# EAGLE design usbasp (EAGLE 5.11)
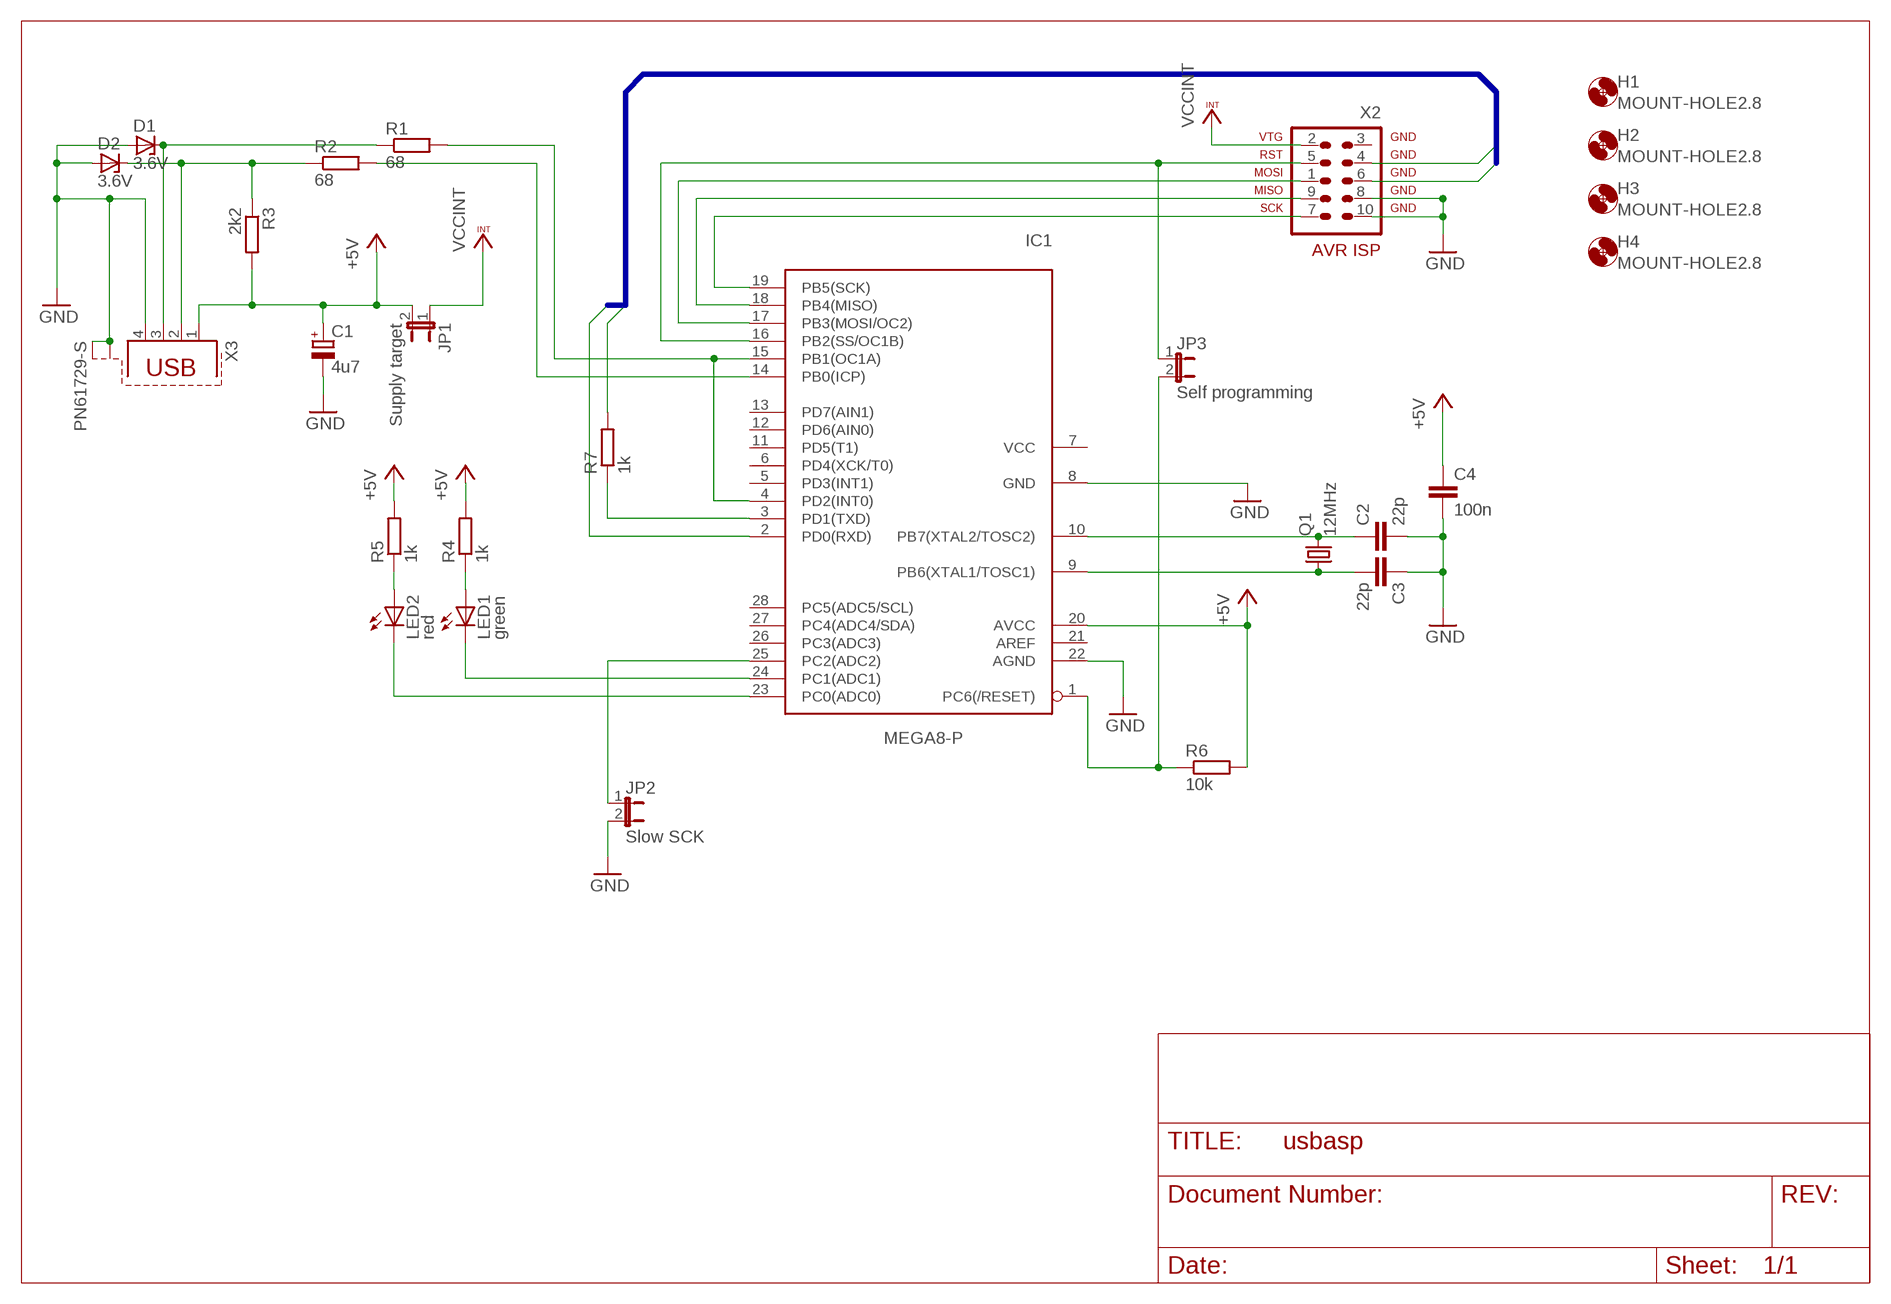
[diagram p0: schematic, sheet 1]

## Parts
C1  4u7  CPOL-EUE2.5-6  [E2,5-6]
C2  22p  C-EU025-024X044  [C025-024X044]
C3  22p  C-EU025-024X044  [C025-024X044]
C4  100n  C-EU025-025X050  [C025-025X050]
D1  3.6V  ZENER-DIODEDO35Z10  [DO35Z10]
D2  3.6V  ZENER-DIODEDO35Z10  [DO35Z10]
H1  MOUNT-HOLE2.8  [2,8]
H2  MOUNT-HOLE2.8  [2,8]
H3  MOUNT-HOLE2.8  [2,8]
H4  MOUNT-HOLE2.8  [2,8]
IC1  MEGA8-P  [DIL28-3]
JP1  Supply target  JP1E  [JP1]
JP2  Slow SCK  JP1E  [JP1]
JP3  Self programming  JP1E  [JP1]
LED1  green  LED3MM  [LED3MM]
LED2  red  LED3MM  [LED3MM]
Q1  12MHz  CRYSTALHC49U70  [HC49U70]
R1  68  R-EU_0207/10  [0207/10]
R2  68  R-EU_0207/10  [0207/10]
R3  2k2  R-EU_0207/10  [0207/10]
R4  1k  R-EU_0207/10  [0207/10]
R5  1k  R-EU_0207/10  [0207/10]
R6  10k  R-EU_0207/10  [0207/10]
R7  1k  R-EU_0207/10  [0207/10]
X2  AVR-ISP-10ML  [ML10]
X3  PN61729-S  [PN61729-S]

## Nets
+5V: C1.+ C4.1 IC1.20(AVCC) JP1.2 R3.2 R4.2 R5.2 R6.2 X3.1
GND: C1.- C2.2 C3.1 C4.2 D1.A D2.A IC1.8(GND) IC1.22(AGND) JP2.2 X2.8 X2.10 X3.4 X3.S1 X3.S2
N$1: D2.C R2.1 R3.1 X3.2
N$2: D1.C R1.1 X3.3
N$3: IC1.4(PD2(INT0)) IC1.15(PB1(OC1A)) R1.2
N$4: IC1.14(PB0(ICP)) R2.2
N$5: IC1.16(PB2(SS/OC1B)) JP3.1 X2.5
N$6: IC1.17(PB3(MOSI/OC2)) X2.1
N$7: IC1.18(PB4(MISO)) X2.9
N$8: IC1.19(PB5(SCK)) X2.7
N$9: C2.1 IC1.10(PB7(XTAL2/TOSC2)) Q1.2
N$10: IC1.25(PC2(ADC2)) JP2.1
N$11: IC1.24(PC1(ADC1)) LED1.K(C)
N$12: C3.2 IC1.9(PB6(XTAL1/TOSC1)) Q1.1
N$13: LED2.A R5.1
N$14: IC1.23(PC0(ADC0)) LED2.K(C)
N$16: LED1.A R4.1
N$17: IC1.3(PD1(TXD)) R7.1
N$19: IC1.1(PC6(/RESET)) JP3.2 R6.1
RXD: IC1.2(PD0(RXD)) X2.6
TXD: R7.2 X2.4
VCCINT: JP1.1 X2.2
Unconnected: IC1.5(PD3(INT1)) IC1.6(PD4(XCK/T0)) IC1.7(VCC) IC1.11(PD5(T1)) IC1.12(PD6(AIN0)) IC1.13(PD7(AIN1)) IC1.21(AREF) IC1.26(PC3(ADC3)) IC1.27(PC4(ADC4/SDA)) IC1.28(PC5(ADC5/SCL)) X2.3

## Buses
SERIAL:RXD,TXD

## Library data of the parts
C1 = resistor:CPOL-EU: POLARIZED CAPACITOR, European symbol
C2-C4 = resistor:C-EU: CAPACITOR, European symbol
D1 D2 = diode:ZENER-DIODE: Z-Diode
H1-H4 = holes:MOUNT-HOLE: MOUNTING HOLE with drill center marker
IC1 = atmel-1:MEGA8-P: MICROCONTROLLER 8 Kbytes FLASH 1 kbytes SRAM 512 bytes EEPROM USART 4-channel 10 bit ADC 2-channel 8 bit ADC
JP1-JP3 = jumper:JP1E: JUMPER
LED1 LED2 = led:LED: LED OSRAM: - CHIPLED LG R971, LG N971, LY N971, LG Q971, LY Q971, LO R971, LY R971 LH N974, LH R974 LS Q976, LO Q976, LY Q976 LO Q996 - Hyper CHIPLED LW Q18S LB Q993, LB Q99A, LB R99A - SideLED LS A670, LO A670, LY A670, LG A670, LP A670 LB A673, LV A673, LT A673, LW A673 LH A674 LY A675 LS A676, LA A676, LO A676, LY A676, LW A676 LS A679, LY A679, LG A679 - Hyper Micro SIDELED® LS Y876, LA Y876, LO Y876, LY Y876 LT Y87S - SmartLED LW L88C, LW L88S LB L89C, LB L89S, LG L890 LS L89K, LO L89K, LY L89K LS L896, LA L896, LO L896, LY L896 - TOPLED LS T670, LO T670, LY T670, LG T670, LP T670 LSG T670, LSP T670, LSY T670, LOP T670, LYG T670 LG T671, LOG T671, LSG T671 LB T673, LV T673, LT T673, LW T673 LH T674 LS T676, LA T676, LO T676, LY T676, LB T676, LH T676, LSB T676, LW T676 LB T67C, LV T67C, LT T67C, LS T67K, LO T67K, LY T67K, LW E67C LS E67B, LA E67B, LO E67B, LY E67B, LB E67C, LV E67C, LT E67C LW T67C LS T679, LY T679, LG T679 LS T770, LO T770, LY T770, LG T770, LP T770 LB T773, LV T773, LT T773, LW T773 LH T774 LS E675, LA E675, LY E675, LS T675 LS T776, LA T776, LO T776, LY T776, LB T776 LHGB T686 LT T68C, LB T68C - Hyper Mini TOPLED® LB M676 - Mini TOPLED Santana® LG M470 LS M47K, LO M47K, LY M47K Source: http://www.osram.convergy.de LUXEON: - LUMILED® LXK2-PW12-R00, LXK2-PW12-S00, LXK2-PW14-U00, LXK2-PW14-V00 LXK2-PM12-R00, LXK2-PM12-S00, LXK2-PM14-U00 LXK2-PE12-Q00, LXK2-PE12-R00, LXK2-PE12-S00, LXK2-PE14-T00, LXK2-PE14-U00 LXK2-PB12-K00, LXK2-PB12-L00, LXK2-PB12-M00, LXK2-PB14-N00, LXK2-PB14-P00, LXK2-PB14-Q00 LXK2-PR12-L00, LXK2-PR12-M00, LXK2-PR14-Q00, LXK2-PR14-R00 LXK2-PD12-Q00, LXK2-PD12-R00, LXK2-PD12-S00 LXK2-PH12-R00, LXK2-PH12-S00 LXK2-PL12-P00, LXK2-PL12-Q00, LXK2-PL12-R00 Source: www.luxeon.com KINGBRIGHT: KA-3528ASYC Source: www.kingbright.com
Q1 = crystal:CRYSTAL: CRYSTAL; OC_FARNELL: unknown; OC_NEWARK: unknown
R1-R7 = resistor:R-EU_: RESISTOR, European symbol
X2 = atmel-1:AVR-ISP-10: AVR ISP-10 Serial Programming Header
X3 = con-berg:PN61729-S: BERG USB connector; OC_FARNELL: unknown; OC_NEWARK: unknown

## Board
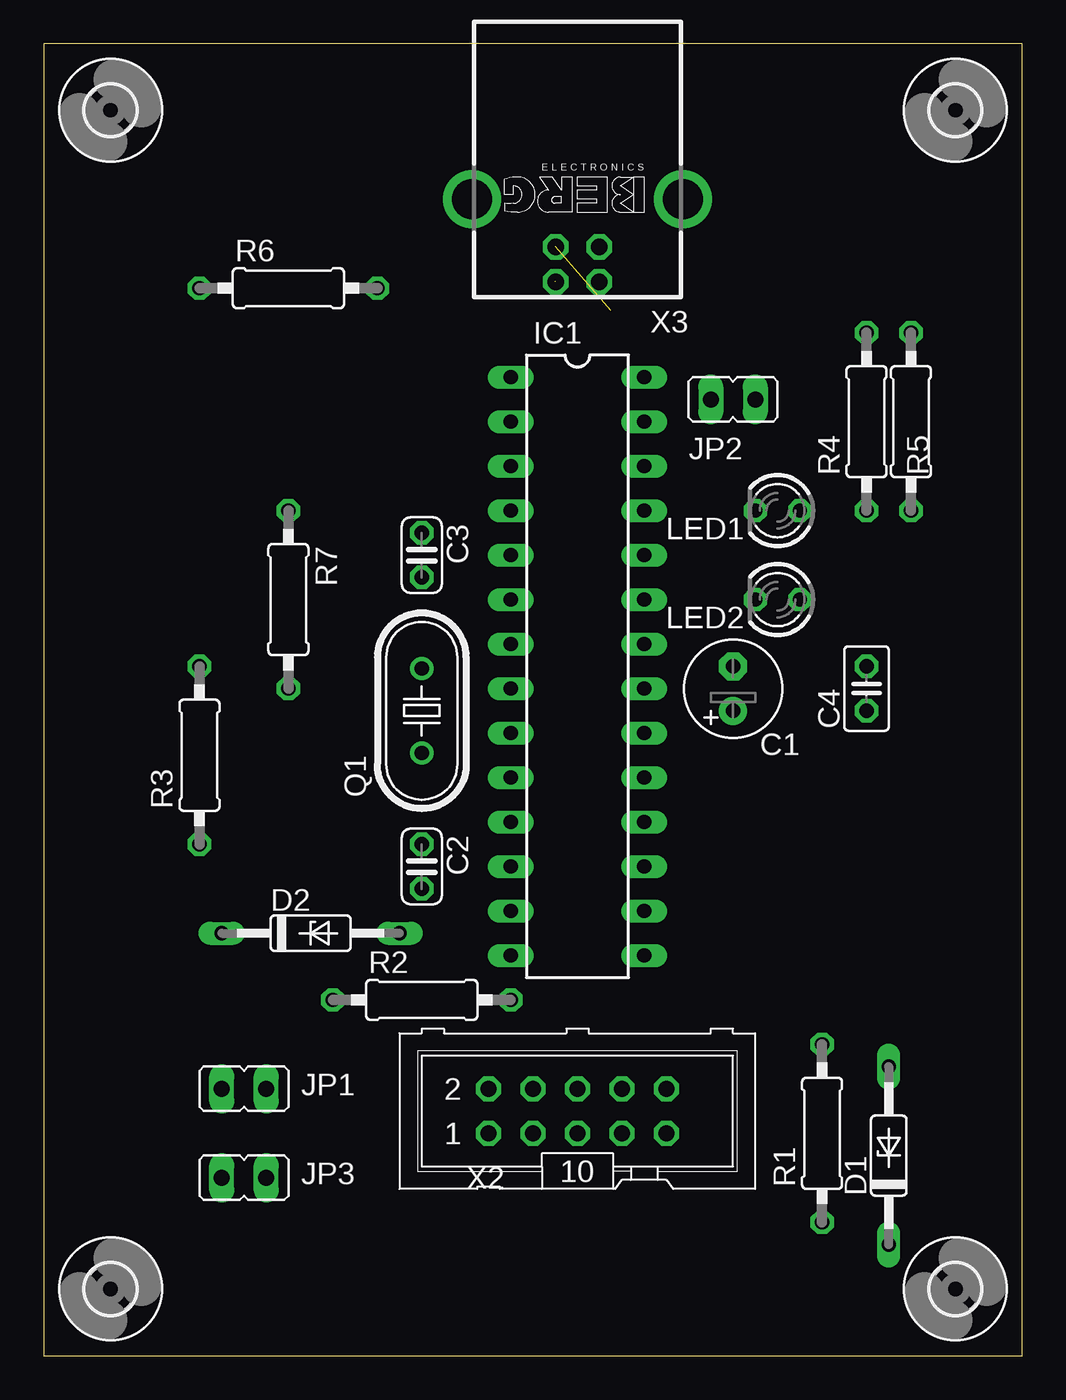
[diagram p1: board, top side]
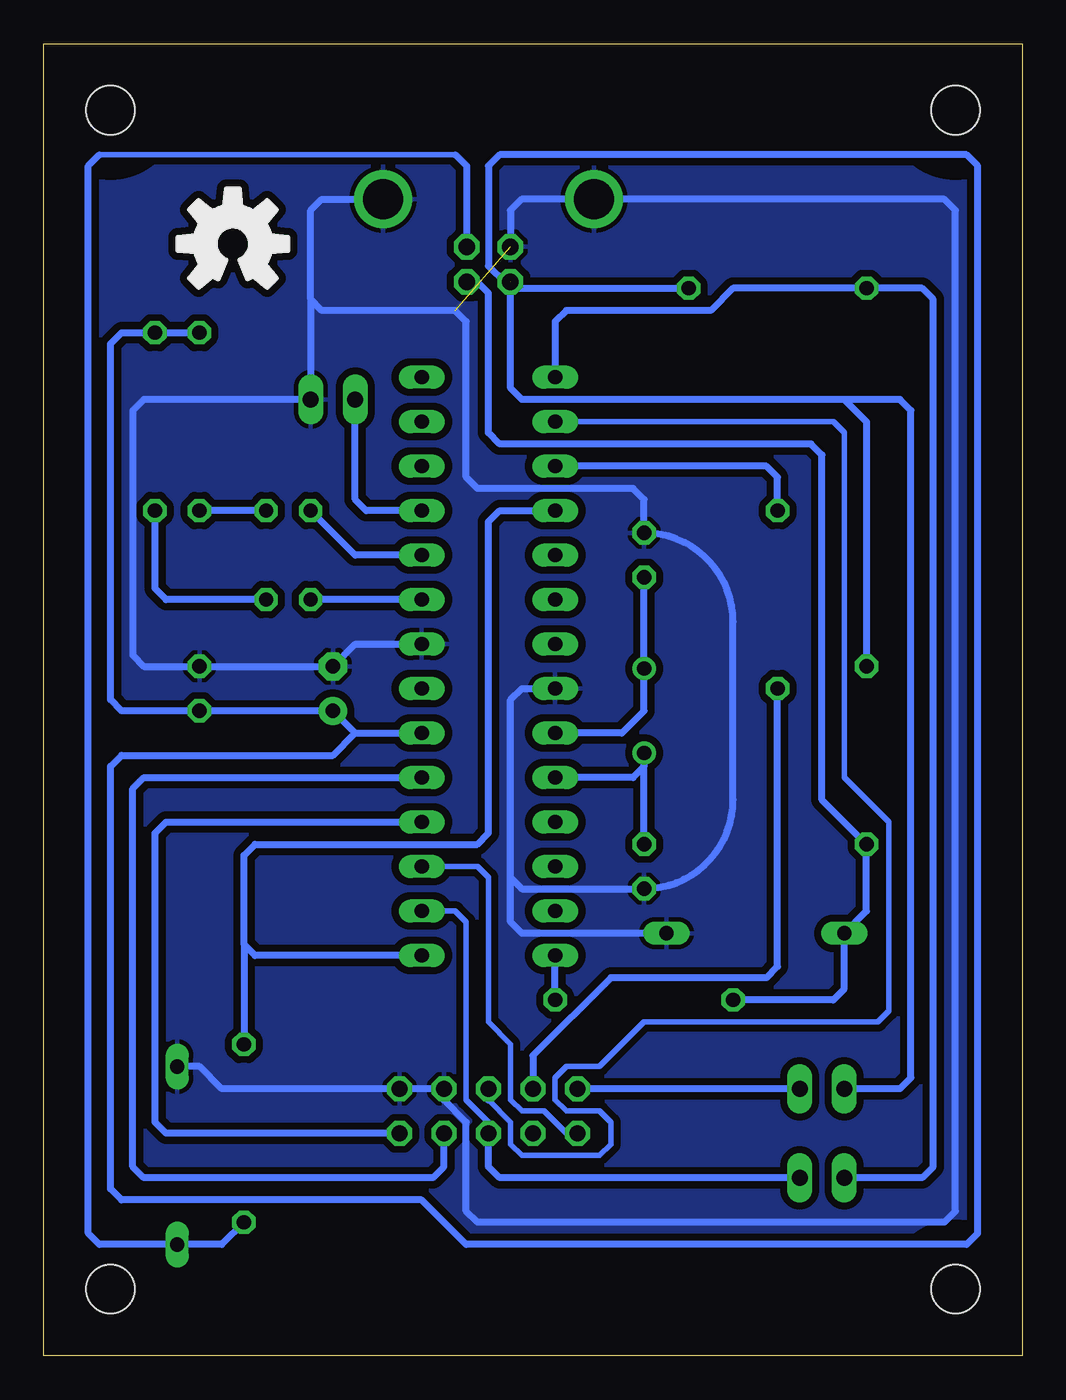
[diagram p2: board, bottom side, seen from below]

Size 55.88 x 74.92 mm. Coordinates in mm from the lower left corner, seen from the top.
Outline: 0,0 55.88,0 55.88,74.92 0,74.92 0,0
Copper layers (1*16): Top 0.035mm / dielectric 1.5mm / Bottom 0.035mm
Design rules "default *": minimum track width 10mil, minimum drill 24mil, track to track 8mil, track to pad 8mil, pad to pad 8mil, via to via 8mil, smd to smd 8mil, copper to edge 30mil, drill to drill 1mil, minimum pad ring 10mil, minimum via ring 8mil, stop-mask expansion 4mil, vias tented up to drill 0mil, thermal gap 10mil

### Footprints (pad centres in the part's own frame; a part is rotated, then mirrored left to right if it is on the bottom)
E2,5-6 = drill 0.813 pad 1.6 round: + -1.27,0 | drill 0.813 pad 1.6 octagon: - 1.27,0
C025-024X044 = drill 0.813 octagon: 1 -1.27,0; 2 1.27,0
C025-025X050 = drill 0.813 octagon: 1 -1.27,0; 2 1.27,0
DO35Z10 = drill 0.813 long: A 5.08,0; C -5.08,0
2,8 = hole 2.8: 0,0
DIL28-3 = drill 0.813 long: 1 -16.51,-3.81; 2 -13.97,-3.81; 3 -11.43,-3.81; 4 -8.89,-3.81; 5 -6.35,-3.81; 6 -3.81,-3.81; 7 -1.27,-3.81; 8 1.27,-3.81; 9 3.81,-3.81; 10 6.35,-3.81; 11 8.89,-3.81; 12 11.43,-3.81; 13 13.97,-3.81; 14 16.51,-3.81; 15 16.51,3.81; 16 13.97,3.81; 17 11.43,3.81; 18 8.89,3.81; 19 6.35,3.81; 20 3.81,3.81; 21 1.27,3.81; 22 -1.27,3.81; 23 -3.81,3.81; 24 -6.35,3.81; 25 -8.89,3.81; 26 -11.43,3.81; 27 -13.97,3.81; 28 -16.51,3.81
JP1 = drill 0.914 long: 1 0,-1.27; 2 0,1.27
LED3MM = drill 0.813 octagon: A -1.27,0; K 1.27,0
HC49U70 = drill 0.813 round: 1 -2.413,0; 2 2.413,0
0207/10 = drill 0.813 octagon: 1 -5.08,0; 2 5.08,0
ML10 = drill 0.914 octagon: 1 -5.08,-1.27; 2 -5.08,1.27; 3 -2.54,-1.27; 4 -2.54,1.27; 5 0,-1.27; 6 0,1.27; 7 2.54,-1.27; 8 2.54,1.27; 9 5.08,-1.27; 10 5.08,1.27
PN61729-S = drill 0.95 octagon: 1 1.25,4.71; 2 -1.25,4.71; 3 -1.25,2.71; 4 1.25,2.71 | drill 2.3 pad 2.9 round: S1 -6.02,0; S2 6.02,0

### Placement (x,y rotation side)
C1  39.37,38.1 90 top
C2  21.59,27.94 270 top
C3  21.59,45.72 270 top
C4  46.99,38.1 90 top
D1  48.26,11.43 90 top
D2  15.24,24.13 0 top
H1  3.81,71.12 0 top
H2  52.07,71.12 0 top
H3  3.81,3.81 0 top
H4  52.07,3.81 0 top
IC1  30.48,39.37 270 top
JP1  11.43,15.24 90 top
JP2  39.37,54.61 270 top
JP3  11.43,10.16 90 top
LED1  41.91,48.26 180 top
LED2  41.91,43.18 180 top
Q1  21.59,36.83 270 top
R1  44.45,12.7 90 top
R2  21.59,20.32 0 top
R3  8.89,34.29 90 top
R4  46.99,53.34 90 top
R5  49.53,53.34 90 top
R6  13.97,60.96 0 top
R7  13.97,43.18 270 top
X2  30.48,13.97 0 top
X3  30.48,66.04 180 top

### Tracks (layer width: path | path; a pad name or v marks a point on that pad's centre or on a via)
+5V  (1 unrouted)
  Bottom 0.406: 38.1,35.56 IC1.20 | 38.1,35.56 C1.+ C4.1 51.44,36.83 52.07,37.47 52.07,57.78 51.44,58.42 R5.2 R4.2 | JP1.2 6.99,15.24 6.35,15.88 6.35,53.98 6.99,54.61 10.16,54.61 | 10.16,54.61 28.57,54.61 29.21,55.24 29.21,61.35 | 38.1,35.56 39.37,34.29 51.44,34.29 52.07,33.66 52.07,9.53 51.44,8.89 34.29,8.89 31.75,6.35 3.17,6.35 2.54,6.99 2.54,67.94 3.17,68.58 29.84,68.58 30.48,67.94 30.48,62.23 29.58,61.33 X3.1 28.86,60.96 R6.2 | R3.2 8.89,53.34 10.16,54.61
GND  (1 unrouted)
  Bottom 0.406: IC1.22 38.1,40.64 C1.- C4.2 50.16,39.37 50.8,40.01 50.8,53.98 50.16,54.61 JP2.2 40.64,60.33 | X3.S1 40.01,66.04 40.64,65.41 40.64,60.33 | X3.4 29.23,65.41 28.59,66.04 X3.S2 4.45,66.04 3.81,65.41 3.81,8.26 4.45,7.62 31.11,7.62 31.75,8.26 31.75,13.34 33.02,14.61 X2.8 X2.10 45.72,15.24 46.99,16.51 D1.A | 40.64,60.33 40.01,59.69 32.38,59.69 31.75,59.05 31.75,50.16 31.11,49.53 22.23,49.53 21.59,48.9 C3.1 arc90 16.51,41.91 16.51,31.75 arc90 C2.2 28.57,26.67 29.21,27.3 | D2.A 28.57,24.13 29.21,24.77 29.21,27.3 | IC1.8 28.57,38.1 29.21,37.47 29.21,27.3
  pour Bottom (isolate 0.406): 0.64,74.3 55.24,74.3 55.24,0.64 0.64,0.64
N$1
  Bottom 0.406: X3.2 31.11,61.33 31.11,61.32 30.48,60.69 30.48,52.7 29.84,52.07 12.06,52.07 11.43,51.44 11.43,31.75 R3.1 8.89,25.4 D2.C 10.16,20.95 10.79,20.32 R2.1
N$2
  Bottom 0.305: 52.7,68.58 32.37,68.58
  Bottom 0.406: 32.37,68.58 31.73,67.94 X3.3 | 52.7,68.58 53.34,67.94 53.34,6.99 52.7,6.35 D1.C 45.72,6.35 R1.1
N$3
  Bottom 0.406: IC1.4 29.84,48.26 30.48,47.62 30.48,29.84 31.11,29.21 43.81,29.21 44.45,28.57 44.45,23.5 | 44.45,23.5 43.81,22.86 IC1.15 | 44.45,23.5 R1.2
N$4
  Bottom 0.406: R2.2 IC1.14
N$5
  Bottom 0.305: IC1.16 32.38,25.4 31.75,24.77 31.75,14.61 30.48,13.34 X2.5
  Bottom 0.406: JP3.1 29.84,10.16 30.48,10.79 X2.5
N$6
  Bottom 0.305: X2.1 26.04,12.7 27.3,13.97 28.57,13.97 29.21,14.61 29.21,17.78 30.48,19.05 30.48,27.3 31.11,27.94 IC1.17
N$7
  Bottom 0.406: X2.9 48.9,12.7 49.53,13.34 49.53,29.84 48.9,30.48 IC1.18
N$8
  Bottom 0.406: X2.7 33.02,10.79 33.66,10.16 50.16,10.16 50.8,10.79 50.8,32.38 50.16,33.02 IC1.19
N$9
  Bottom 0.406: IC1.10 22.23,33.02 21.59,33.66 Q1.2 C2.1
N$10
  Bottom 0.406: IC1.25 37.47,48.26 38.1,48.9 JP2.1
N$11
  Bottom 0.406: IC1.24 38.1,45.72 LED1.K
N$12
  Bottom 0.406: C3.2 Q1.1 21.59,36.83 22.86,35.56 IC1.9
N$13
  Bottom 0.406: LED2.A 48.9,43.18 49.53,43.81 R5.1
N$14
  Bottom 0.406: IC1.23 LED2.K
N$15
  Bottom 0.254: 43.93,61.65 arc10 44.25,61.48 44.7,62.58 arc-248 46.08,63.5 arc-68 45.47,62.58 45.92,61.48 arc10 46.24,61.65 47.04,61 47.59,61.55 46.94,62.34 arc19 47.21,63.01 48.24,63.11 48.24,63.89 47.21,63.99 arc19 46.94,64.66 47.59,65.45 47.04,66 46.24,65.35 arc19 45.58,65.63 45.47,66.65 44.7,66.65 44.59,65.63 arc19 43.93,65.35 43.13,66 42.58,65.45 43.23,64.66 arc19 42.96,63.99 41.93,63.89 41.93,63.11 42.96,63.01 arc19 43.23,62.34 42.58,61.55 43.13,61 43.93,61.65
N$16
  Bottom 0.406: LED1.A R4.1
N$17
  Bottom 0.406: R7.1 13.97,50.16 14.61,50.8 IC1.3
N$19
  Bottom 0.406: IC1.1 26.67,59.05 26.04,59.69 17.78,59.69 16.51,60.96 R6.1 5.71,60.96 5.08,60.33 5.08,10.79 5.71,10.16 JP3.2
RXD
  Bottom 0.305: IC1.2 10.79,53.34 10.16,52.7 10.16,33.02 7.62,30.48 7.62,19.68 8.26,19.05 21.59,19.05 24.13,16.51 26.04,16.51 26.67,15.88 26.67,14.61 26.04,13.97 24.13,13.97 23.5,13.34 23.5,12.06 24.13,11.43 28.57,11.43 29.21,12.06 29.21,13.34 30.48,14.61
  Bottom 0.406: 30.48,14.61 X2.6
TXD
  Bottom 0.406: X2.4 27.94,17.14 23.5,21.59 14.61,21.59 13.97,22.23 R7.2
VCCINT
  Bottom 0.406: JP1.1 X2.2